# Altium schematic sheet Connector.SchDoc
size A3
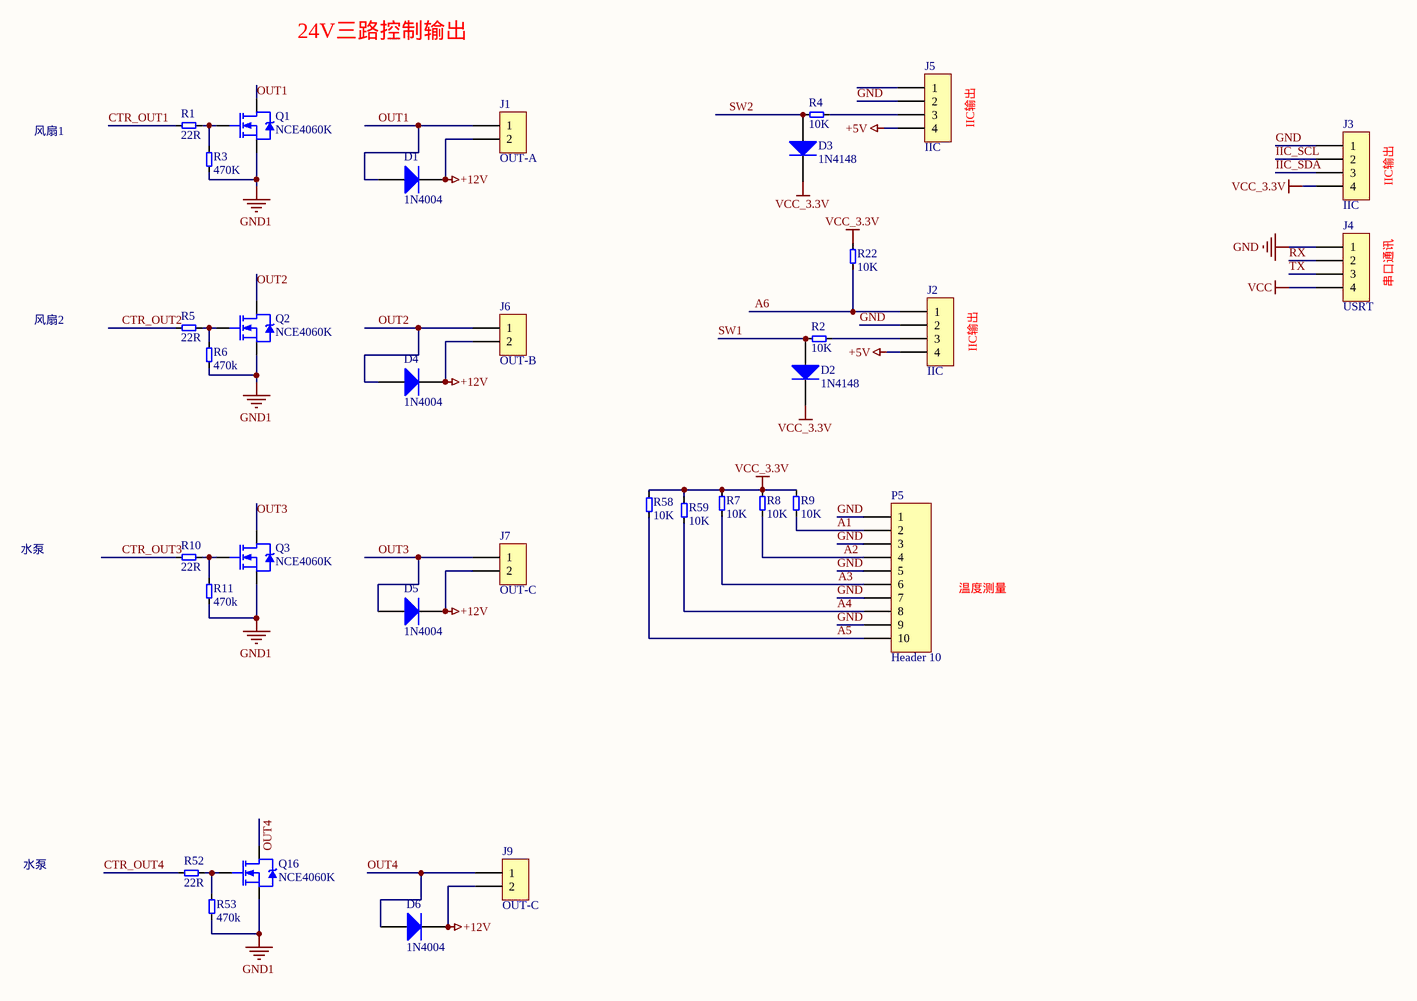
[diagram p0: Connector.SchDoc]

## Parts
D1  1N4004  [D7227]
D2  1N4148  [sod323]
D3  1N4148  [sod323]
D4  1N4004  [D7227]
D5  1N4004  [D7227]
D6  1N4004  [D7227]
J1  OUT-A  [SIP-2L]
J2  IIC  [SIP-4L]
J3  IIC  [SIP-4L]
J4  USRT  [SIP-4L]
J5  IIC  [SIP-4L]
J6  OUT-B  [SIP-2L]
J7  OUT-C  [SIP-2L]
J9  OUT-C  [SIP-2L]
P5  Header 10  [SIP-10L]
Q1  NCE4060K  [TO-252-3S]
Q2  NCE4060K  [TO-252-3S]
Q3  NCE4060K  [TO-252-3S]
Q16  NCE4060K  [TO-252-3S]
R1  22R  [0805R]
R2  10K  [0805R]
R3  470K  [0805R]
R4  10K  [0805R]
R5  22R  [0805R]
R6  470k  [0805R]
R7  10K  [0805R]
R8  10K  [0805R]
R9  10K  [0805R]
R10  22R  [0805R]
R11  470k  [0805R]
R22  10K  [0805R]
R52  22R  [0805R]
R53  470k  [0805R]
R58  10K  [0805R]
R59  10K  [0805R]

## Nets
+5V: J2.4 J5.4
+12V: D1.K D4.K D5.K D6.K J1.2 J6.2 J7.2 J9.2
GND: J2.2 J3.1 J4.1 J5.2 P5.1 P5.3 P5.5 P5.7 P5.9
GND1: Q1.3(S) Q2.3(S) Q3.3(S) Q16.3(S) R3.1 R6.1 R11.1 R53.1
VCC: J4.4
VCC_3.3V: D2.K D3.K J3.4 R7.2 R8.2 R9.2 R22.2 R58.2 R59.1
A1: P5.2 R9.1
A2: P5.4 R8.1
A3: P5.6 R7.1
A4: P5.8 R59.2
A5: P5.10 R58.1
A6: J2.1 R22.1
CTR_OUT1: R1.1
CTR_OUT2: R5.1
CTR_OUT3: R10.1
CTR_OUT4: R52.1
IIC_SCL: J3.2
IIC_SDA: J3.3
OUT1: D1.A J1.1 Q1.2(D)
OUT2: D4.A J6.1 Q2.2(D)
OUT3: D5.A J7.1 Q3.2(D)
OUT4: D6.A J9.1 Q16.2(D)
RX: J4.2
SW1: D2.A R2.2
SW2: D3.A R4.2
TX: J4.3
NetJ2_3: J2.3 R2.1
NetJ5_3: J5.3 R4.1
NetQ1_1: Q1.1(G) R1.2 R3.2
NetQ2_1: Q2.1(G) R5.2 R6.2
NetQ3_1: Q3.1(G) R10.2 R11.2
NetQ16_1: Q16.1(G) R52.2 R53.2

Not connected (* = marked no-connect by the designer): J5 1

## Notes on the sheet
- 24V三路控制输出
- 风扇1
- (near J5) IIC输出
- (near J3) IIC输出
- (near J4) 串口通讯
- 风扇2
- (near J2) IIC输出
- 水泵
- 温度测量

## Library data of the parts
D1 D4-D6 = Diode_2: Default Diode; Published: 8-Jun-2000; LatestRevisionDate: 17-Jul-2002; LatestRevisionNote: Re-released for DXP Platform.; PackageVersion: Sep-1996; PackageReference: SMC; Publisher: Altium Limited; PackageDescription: DO-214-AB/SMC; 2 C-Bend Leads; Body 7.9 x 5.9 mm, inc. leads (LxW); Code_JEDEC: DO-214-AB
D2 D3 = Diode: Default Diode; Published: 8-Jun-2000; LatestRevisionDate: 17-Jul-2002; LatestRevisionNote: Re-released for DXP Platform.; PackageVersion: Sep-1996; PackageReference: SMC; Publisher: Altium Limited; Code_JEDEC: DO-214-AB
J1 J6 J7 J9 = CON2: Connector
J2-J5 = SIP4-2.54: CN-SIP4-2.54
P5 = Header 10: Header, 10-Pin; LatestRevisionDate: 17-Jul-2002; LatestRevisionNote: Re-released for DXP Platform.; Publisher: Altium Limited
Q1-Q3 Q16 = NCE4060K: NMOSFET
R1-R11 R22 R52 R53 R58 R59 = 1K: CR85-102J